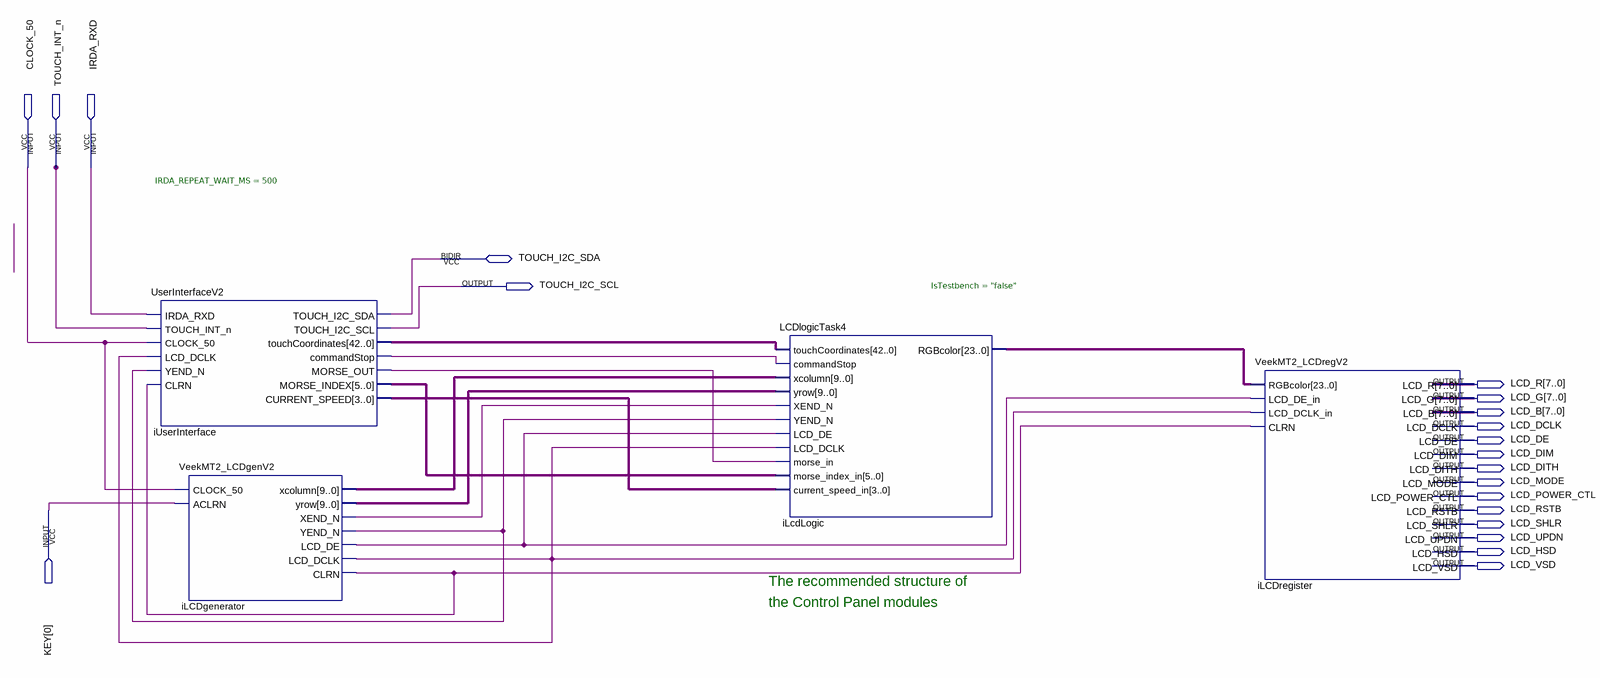
[diagram p0: schematic sheet]
// Quartus schematic Demo_ControlPanel.bdf as structural Verilog: 4 symbols, 20 pins
module Demo_ControlPanel (
  input  CLOCK_50,
  input  TOUCH_INT_n,
  input  IRDA_RXD,
  input  [0:0] KEY,
  inout  TOUCH_I2C_SDA,
  output TOUCH_I2C_SCL,
  output [7:0] LCD_R,
  output [7:0] LCD_G,
  output [7:0] LCD_B,
  output LCD_DCLK,
  output LCD_DE,
  output LCD_DIM,
  output LCD_DITH,
  output LCD_MODE,
  output LCD_POWER_CTL,
  output LCD_RSTB,
  output LCD_SHLR,
  output LCD_UPDN,
  output LCD_HSD,
  output LCD_VSD
);

  wire iLCDgenerator_clrn, iLCDgenerator_lcd_dclk, iLCDgenerator_lcd_de, iLCDgenerator_xend_n,
       iLCDgenerator_yend_n, iUserInterface_commandstop, iUserInterface_morse_out;
  wire [3:0] iUserInterface_current_speed;
  wire [5:0] iUserInterface_morse_index;
  wire [9:0] iLCDgenerator_xcolumn, iLCDgenerator_yrow;
  wire [23:0] iLcdLogic_rgbcolor;
  wire [42:0] iUserInterface_touchcoordinates;

  UserInterfaceV2 #(.IRDA_REPEAT_WAIT_MS(500)) iUserInterface (
    .IRDA_RXD(IRDA_RXD), .TOUCH_INT_n(TOUCH_INT_n), .CLOCK_50(CLOCK_50), .LCD_DCLK(iLCDgenerator_lcd_dclk),
    .YEND_N(iLCDgenerator_yend_n), .CLRN(iLCDgenerator_clrn), .TOUCH_I2C_SCL(TOUCH_I2C_SCL),
    .touchCoordinates(iUserInterface_touchcoordinates), .commandStop(iUserInterface_commandstop),
    .MORSE_OUT(iUserInterface_morse_out), .MORSE_INDEX(iUserInterface_morse_index),
    .CURRENT_SPEED(iUserInterface_current_speed), .TOUCH_I2C_SDA(TOUCH_I2C_SDA));
  VeekMT2_LCDgenV2 iLCDgenerator (
    .CLOCK_50(CLOCK_50), .ACLRN(KEY[0]), .xcolumn(iLCDgenerator_xcolumn), .yrow(iLCDgenerator_yrow),
    .XEND_N(iLCDgenerator_xend_n), .YEND_N(iLCDgenerator_yend_n), .LCD_DE(iLCDgenerator_lcd_de),
    .LCD_DCLK(iLCDgenerator_lcd_dclk), .CLRN(iLCDgenerator_clrn));
  LCDlogicTask4 #(.IsTestbench("false")) iLcdLogic (
    .touchCoordinates(iUserInterface_touchcoordinates), .commandStop(iUserInterface_commandstop),
    .xcolumn(iLCDgenerator_xcolumn), .yrow(iLCDgenerator_yrow), .XEND_N(iLCDgenerator_xend_n),
    .YEND_N(iLCDgenerator_yend_n), .LCD_DE(iLCDgenerator_lcd_de), .LCD_DCLK(iLCDgenerator_lcd_dclk),
    .morse_in(iUserInterface_morse_out), .morse_index_in(iUserInterface_morse_index),
    .current_speed_in(iUserInterface_current_speed), .RGBcolor(iLcdLogic_rgbcolor));
  VeekMT2_LCDregV2 iLCDregister (
    .RGBcolor(iLcdLogic_rgbcolor), .LCD_DE_in(iLCDgenerator_lcd_de), .LCD_DCLK_in(iLCDgenerator_lcd_dclk),
    .CLRN(iLCDgenerator_clrn), .LCD_R(LCD_R), .LCD_G(LCD_G), .LCD_B(LCD_B), .LCD_DCLK(LCD_DCLK),
    .LCD_DE(LCD_DE), .LCD_DIM(LCD_DIM), .LCD_DITH(LCD_DITH), .LCD_MODE(LCD_MODE),
    .LCD_POWER_CTL(LCD_POWER_CTL), .LCD_RSTB(LCD_RSTB), .LCD_SHLR(LCD_SHLR), .LCD_UPDN(LCD_UPDN),
    .LCD_HSD(LCD_HSD), .LCD_VSD(LCD_VSD));

  // Notes on the sheet:
  //   The recommended structure of 
  //   the Control Panel modules
endmodule
